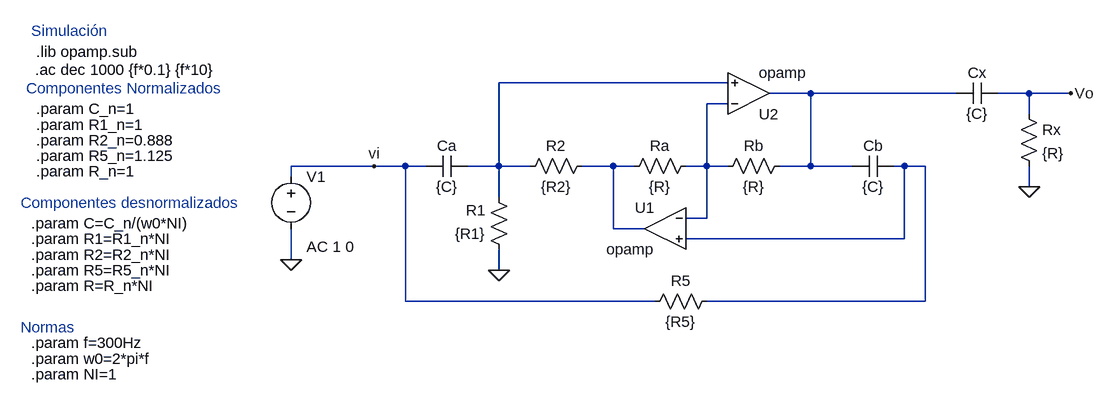
[diagram p0: schematic TS5.asc]
TS5.asc, the LTspice schematic file:
Version 4
SHEET 1 880 680
WIRE 272 96 -80 96
WIRE 400 112 336 112
WIRE 624 112 400 112
WIRE 736 112 688 112
WIRE 800 112 736 112
WIRE 272 128 240 128
WIRE 736 144 736 112
WIRE -272 224 -400 224
WIRE -224 224 -272 224
WIRE -192 224 -224 224
WIRE -80 224 -80 96
WIRE -80 224 -128 224
WIRE -32 224 -80 224
WIRE 96 224 48 224
WIRE 128 224 96 224
WIRE 240 224 240 128
WIRE 240 224 208 224
WIRE 272 224 240 224
WIRE 400 224 400 112
WIRE 400 224 352 224
WIRE 464 224 400 224
WIRE 544 224 528 224
WIRE 576 224 544 224
WIRE -400 240 -400 224
WIRE 736 256 736 224
WIRE -80 272 -80 224
WIRE 240 304 240 224
WIRE 240 304 208 304
WIRE 96 320 96 224
WIRE 144 320 96 320
WIRE 544 336 544 224
WIRE 544 336 208 336
WIRE -400 368 -400 320
WIRE -80 384 -80 352
WIRE -224 432 -224 224
WIRE 160 432 -224 432
WIRE 576 432 576 224
WIRE 576 432 240 432
FLAG -80 384 0
FLAG -272 224 vi
FLAG -400 368 0
FLAG 736 256 0
FLAG 800 112 Vo
SYMBOL OpAmps\\opamp 176 256 M0
SYMATTR InstName U1
SYMBOL OpAmps\\opamp 304 176 M180
SYMATTR InstName U2
SYMBOL res 368 208 R90
WINDOW 0 0 56 VBottom 2
WINDOW 3 32 56 VTop 2
SYMATTR InstName Rb
SYMATTR Value {R}
SYMBOL res 224 208 R90
WINDOW 0 0 56 VBottom 2
WINDOW 3 32 56 VTop 2
SYMATTR InstName Ra
SYMATTR Value {R}
SYMBOL res 64 208 R90
WINDOW 0 0 56 VBottom 2
WINDOW 3 32 56 VTop 2
SYMATTR InstName R2
SYMATTR Value {R2}
SYMBOL res -64 368 R180
WINDOW 0 36 76 Left 2
WINDOW 3 36 40 Left 2
SYMATTR InstName R1
SYMATTR Value {R1}
SYMBOL cap -128 208 R90
WINDOW 0 0 32 VBottom 2
WINDOW 3 32 32 VTop 2
SYMATTR InstName Ca
SYMATTR Value {C}
SYMBOL cap 528 208 R90
WINDOW 0 0 32 VBottom 2
WINDOW 3 32 32 VTop 2
SYMATTR InstName Cb
SYMATTR Value {C}
SYMBOL res 256 416 R90
WINDOW 0 0 56 VBottom 2
WINDOW 3 32 56 VTop 2
SYMATTR InstName R5
SYMATTR Value {R5}
SYMBOL voltage -400 224 R0
WINDOW 123 24 124 Left 2
WINDOW 39 0 0 Left 0
SYMATTR InstName V1
SYMATTR Value ""
SYMATTR Value2 AC 1 0
SYMBOL cap 688 96 R90
WINDOW 0 0 32 VBottom 2
WINDOW 3 32 32 VTop 2
SYMATTR InstName Cx
SYMATTR Value {C}
SYMBOL res 720 128 R0
SYMATTR InstName Rx
SYMATTR Value {R}
TEXT -792 48 Left 2 !.lib opamp.sub
TEXT -800 520 Left 2 !.param w0=2*pi*f
TEXT -800 496 Left 2 !.param f=300Hz
TEXT -792 136 Left 2 !.param C_n=1
TEXT -794 76 Left 2 !.ac dec 1000 {f*0.1} {f*10}
TEXT -808 104 Left 2 ;Componentes Normalizados
TEXT -792 160 Left 2 !.param R1_n=1
TEXT -792 184 Left 2 !.param R2_n=0.888
TEXT -792 208 Left 2 !.param R5_n=1.125
TEXT -792 232 Left 2 !.param R_n=1
TEXT -816 280 Left 2 ;Componentes desnormalizados
TEXT -800 312 Left 2 !.param C=C_n/(w0*NI)
TEXT -800 336 Left 2 !.param R1=R1_n*NI
TEXT -800 360 Left 2 !.param R2=R2_n*NI
TEXT -800 384 Left 2 !.param R5=R5_n*NI
TEXT -800 408 Left 2 !.param R=R_n*NI
TEXT -816 472 Left 2 ;Normas
TEXT -800 544 Left 2 !.param NI=1
TEXT -800 16 Left 2 ;Simulación

The netlist it stands for:
* TS5.asc
XU1 N003 N005 N004 opamp Aol=100K GBW=10Meg  ; pins invin noninvin out
XU2 N003 N001 N002 opamp Aol=100K GBW=10Meg  ; pins invin noninvin out
Rb N002 N003 {R}
Ra N003 N004 {R}
R2 N004 N001 {R2}
R1 0 N001 {R1}
Ca N001 vi {C}
Cb N005 N002 {C}
R5 N005 vi {R5}
V1 vi 0 AC 1 0
Cx Vo N002 {C}
Rx Vo 0 {R}
.lib opamp.sub
.param w0=2*pi*f
.param f=300Hz
.param C_n=1
.ac dec 1000 {f*0.1} {f*10}
* Componentes Normalizados
.param R1_n=1
.param R2_n=0.888
.param R5_n=1.125
.param R_n=1
* Componentes desnormalizados
.param C=C_n/(w0*NI)
.param R1=R1_n*NI
.param R2=R2_n*NI
.param R5=R5_n*NI
.param R=R_n*NI
* Normas
.param NI=1
* Simulación
.backanno
.end